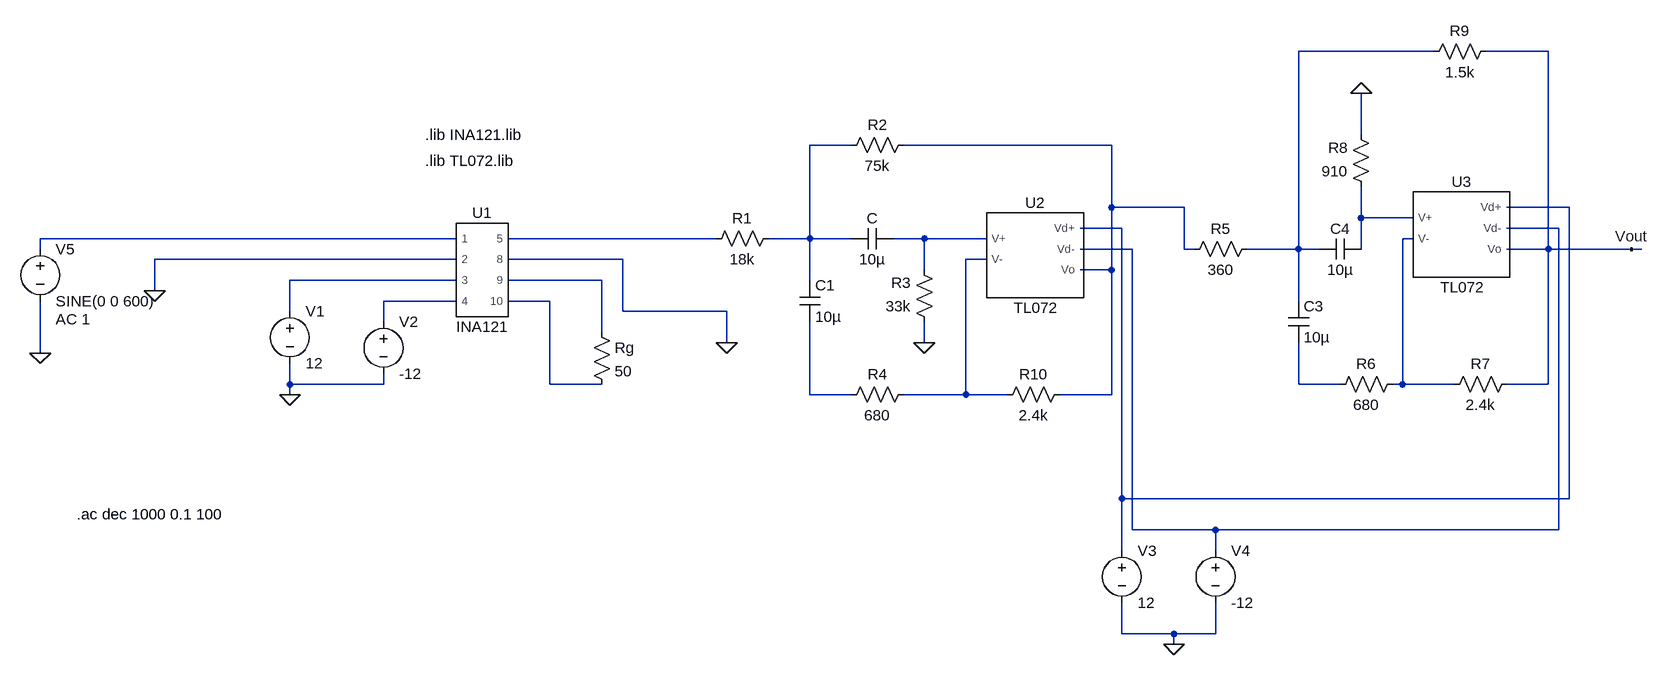
[diagram p0: schematic amp_stage.asc]
amp_stage.asc, the LTspice schematic file:
Version 4
SHEET 1 2028 900
WIRE 1680 -112 1472 -112
WIRE 1856 -112 1760 -112
WIRE 1568 16 1568 -48
WIRE 784 32 720 32
WIRE 1184 32 864 32
WIRE 1184 128 1184 32
WIRE 1296 128 1184 128
WIRE 1888 128 1792 128
WIRE 1568 144 1568 96
WIRE 1648 144 1568 144
WIRE 1200 160 1136 160
WIRE 1872 160 1792 160
WIRE 176 176 -464 176
WIRE 576 176 256 176
WIRE 720 176 720 32
WIRE 720 176 656 176
WIRE 784 176 720 176
WIRE 896 176 848 176
WIRE 992 176 896 176
WIRE 1648 176 1632 176
WIRE -464 192 -464 176
WIRE 1216 192 1136 192
WIRE 1296 192 1296 128
WIRE 1312 192 1296 192
WIRE 1472 192 1472 -112
WIRE 1472 192 1392 192
WIRE 1504 192 1472 192
WIRE 1568 192 1568 144
WIRE 1856 192 1856 -112
WIRE 1856 192 1792 192
WIRE 1984 192 1856 192
WIRE 2000 192 1984 192
WIRE 176 208 -288 208
WIRE 432 208 256 208
WIRE 992 208 960 208
WIRE 896 224 896 176
WIRE 1184 224 1184 128
WIRE 1184 224 1136 224
WIRE 176 240 -80 240
WIRE 400 240 256 240
WIRE 720 240 720 176
WIRE -288 256 -288 208
WIRE 176 272 64 272
WIRE 320 272 256 272
WIRE 1472 272 1472 192
WIRE -80 288 -80 240
WIRE 432 288 432 208
WIRE 592 288 432 288
WIRE 64 304 64 272
WIRE 400 320 400 240
WIRE 592 336 592 288
WIRE 896 336 896 304
WIRE -464 352 -464 272
WIRE -80 400 -80 368
WIRE 64 400 64 384
WIRE 64 400 -80 400
WIRE 320 400 320 272
WIRE 400 400 320 400
WIRE 1472 400 1472 336
WIRE 1536 400 1472 400
WIRE 1632 400 1632 176
WIRE 1632 400 1616 400
WIRE 1712 400 1632 400
WIRE 1856 400 1856 192
WIRE 1856 400 1792 400
WIRE -80 416 -80 400
WIRE 720 416 720 304
WIRE 784 416 720 416
WIRE 960 416 960 208
WIRE 960 416 864 416
WIRE 1024 416 960 416
WIRE 1184 416 1184 224
WIRE 1184 416 1104 416
WIRE 1200 576 1200 160
WIRE 1888 576 1888 128
WIRE 1888 576 1200 576
WIRE 1216 624 1216 192
WIRE 1344 624 1216 624
WIRE 1872 624 1872 160
WIRE 1872 624 1344 624
WIRE 1200 656 1200 576
WIRE 1344 656 1344 624
WIRE 1200 784 1200 736
WIRE 1280 784 1200 784
WIRE 1344 784 1344 736
WIRE 1344 784 1280 784
WIRE 1280 800 1280 784
FLAG -80 416 0
FLAG 896 336 0
FLAG 1280 800 0
FLAG 1568 -48 0
FLAG 1984 192 Vout
FLAG -288 256 0
FLAG -464 352 0
FLAG 592 336 0
SYMBOL INA121 208 224 R0
SYMATTR InstName U1
SYMBOL TL072 1024 192 R0
SYMATTR InstName U2
SYMBOL voltage -80 272 R0
WINDOW 123 0 0 Left 0
WINDOW 39 0 0 Left 0
SYMATTR InstName V1
SYMATTR Value 12
SYMBOL voltage 64 288 R0
WINDOW 123 0 0 Left 0
WINDOW 39 0 0 Left 0
SYMATTR InstName V2
SYMATTR Value -12
SYMBOL res 384 304 R0
SYMATTR InstName Rg
SYMATTR Value 50
SYMBOL TL072 1680 160 R0
SYMATTR InstName U3
SYMBOL res 672 160 R90
WINDOW 0 0 56 VBottom 2
WINDOW 3 32 56 VTop 2
SYMATTR InstName R1
SYMATTR Value 18k
SYMBOL cap 704 240 R0
SYMATTR InstName C1
SYMATTR Value 10µ
SYMBOL res 880 16 R90
WINDOW 0 0 56 VBottom 2
WINDOW 3 32 56 VTop 2
SYMATTR InstName R2
SYMATTR Value 75k
SYMBOL res 912 320 R180
WINDOW 0 36 76 Left 2
WINDOW 3 36 40 Left 2
SYMATTR InstName R3
SYMATTR Value 33k
SYMBOL res 768 432 R270
WINDOW 0 32 56 VTop 2
WINDOW 3 0 56 VBottom 2
SYMATTR InstName R4
SYMATTR Value 680
SYMBOL cap 848 160 R90
WINDOW 0 0 32 VBottom 2
WINDOW 3 32 32 VTop 2
SYMATTR InstName C
SYMATTR Value 10µ
SYMBOL voltage 1200 640 R0
WINDOW 123 0 0 Left 0
WINDOW 39 0 0 Left 0
SYMATTR InstName V3
SYMATTR Value 12
SYMBOL voltage 1344 640 R0
WINDOW 123 0 0 Left 0
WINDOW 39 0 0 Left 0
SYMATTR InstName V4
SYMATTR Value -12
SYMBOL res 1408 176 R90
WINDOW 0 0 56 VBottom 2
WINDOW 3 32 56 VTop 2
SYMATTR InstName R5
SYMATTR Value 360
SYMBOL cap 1456 272 R0
SYMATTR InstName C3
SYMATTR Value 10µ
SYMBOL cap 1568 176 R90
WINDOW 0 0 32 VBottom 2
WINDOW 3 32 32 VTop 2
SYMATTR InstName C4
SYMATTR Value 10µ
SYMBOL res 1632 384 R90
WINDOW 0 0 56 VBottom 2
WINDOW 3 32 56 VTop 2
SYMATTR InstName R6
SYMATTR Value 680
SYMBOL res 1808 384 R90
WINDOW 0 0 56 VBottom 2
WINDOW 3 32 56 VTop 2
SYMATTR InstName R7
SYMATTR Value 2.4k
SYMBOL res 1584 112 R180
WINDOW 0 36 76 Left 2
WINDOW 3 36 40 Left 2
SYMATTR InstName R8
SYMATTR Value 910
SYMBOL res 1664 -96 R270
WINDOW 0 32 56 VTop 2
WINDOW 3 0 56 VBottom 2
SYMATTR InstName R9
SYMATTR Value 1.5k
SYMBOL res 1120 400 R90
WINDOW 0 0 56 VBottom 2
WINDOW 3 32 56 VTop 2
SYMATTR InstName R10
SYMATTR Value 2.4k
SYMBOL voltage -464 176 R0
WINDOW 123 24 124 Left 2
WINDOW 39 0 0 Left 0
SYMATTR Value2 AC 1
SYMATTR InstName V5
SYMATTR Value SINE(0 0 600)
TEXT 128 16 Left 2 !.lib INA121.lib
TEXT 128 56 Left 2 !.lib TL072.lib
TEXT -408 600 Left 2 !.ac dec 1000 0.1 100

The netlist it stands for:
* amp_stage.asc
XU1 N007 0 N012 N014 N008 0 N013 N015 INA121  ; pins 1 2 3 4 5 8 9 10
XU2 N009 N011 N004 N006 N003 TL072  ; pins V+ V- Vd+ Vd- Vo
V1 N012 0 12
V2 N014 0 -12
Rg N013 N015 50
XU3 N005 N010 N004 N006 Vout TL072  ; pins V+ V- Vd+ Vd- Vo
R1 N002 N008 18k
C1 N002 N017 10µ
R2 N003 N002 75k
R3 0 N009 33k
R4 N017 N011 680
C N009 N002 10µ
V3 N004 0 12
V4 N006 0 -12
R5 N001 N003 360
C3 N001 N016 10µ
C4 N005 N001 10µ
R6 N010 N016 680
R7 Vout N010 2.4k
R8 N005 0 910
R9 N001 Vout 1.5k
R10 N003 N011 2.4k
V5 N007 0 SINE(0 0 600) AC 1
.lib INA121.lib
.lib TL072.lib
.ac dec 1000 0.1 100
.lib C:\Users\emanu\Documents\PROGETTI\PSP-PlantSignalProcessing\Hardware\biopotential\simulation\INA121.lib
.lib C:\Users\emanu\Documents\POLITO\PROGETTI\PSP-PlantSignalProcessing\biopotential\simulation\TL072.lib
.backanno
.end